# EAGLE design one_led (EAGLE 6.5.0)
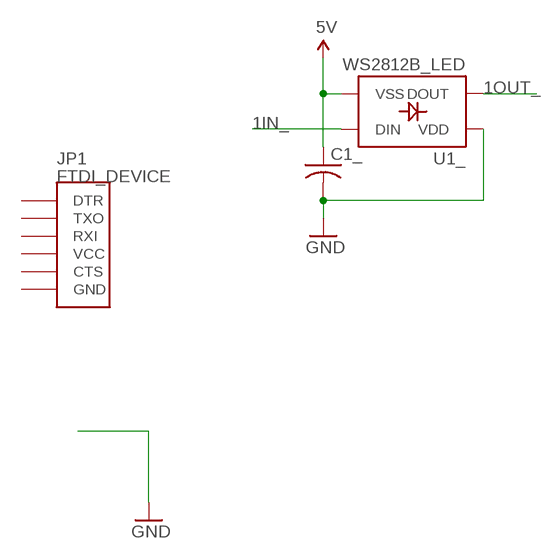
[diagram p0: schematic, sheet 1]

## Parts
C1_  C-USC0603K  [C0603K]
JP1  FTDI_DEVICE  [FTDI_DEVICE_SIDE]
U1_  WS2812B_LED  [WS2812B_LED]

## Nets
1IN_: U1_.DIN
1OUT_: U1_.DOUT
5V: C1_.1 U1_.VSS
GND: C1_.2 U1_.VDD
Unconnected: JP1.P$1(DTR) JP1.P$2(TXO) JP1.P$3(RXI) JP1.P$4(VCC) JP1.P$5(CTS) JP1.P$6(GND)

## Library data of the parts
C1_ = adafruit:C-US: CAPACITOR, American symbol
JP1 = SparkFun-Connectors:FTDI_DEVICE: Connector which mates to FTDI basic or FTDI cable.
U1_ = blinkinlabs:WS2812B_LED

## Board
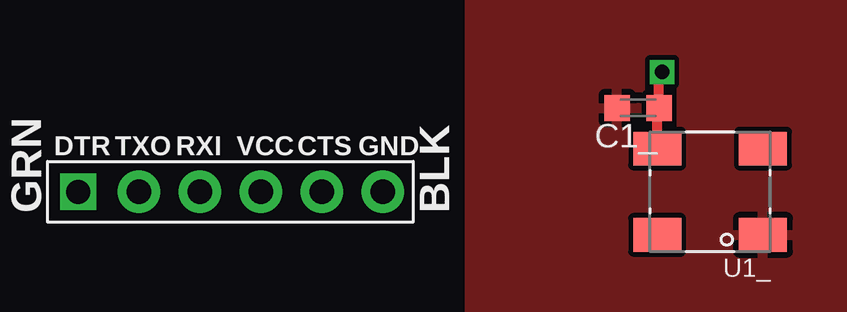
[diagram p1: board, top side]
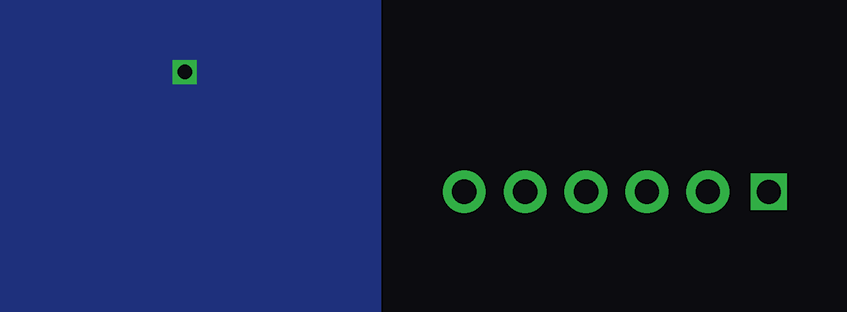
[diagram p2: board, bottom side, seen from below]

No outline drawn. Coordinates in mm, seen from the top.
Copper layers (1*16): Top 0.035mm / dielectric 1.5mm / Bottom 0.035mm
Design rules "default": minimum track width 10mil, minimum drill 24mil, track to track 8mil, track to pad 8mil, pad to pad 8mil, via to via 8mil, smd to smd 8mil, copper to edge 40mil, drill to drill 8mil, minimum pad ring 10mil, minimum via ring 8mil, stop-mask expansion 4mil, vias tented up to drill 0mil, thermal gap 10mil

### Footprints (pad centres in the part's own frame; a part is rotated, then mirrored left to right if it is on the bottom)
C0603K = smd 1.05 x 1.08: 1 -0.875,0; 2 0.875,0
FTDI_DEVICE_SIDE = drill 1 square: P$1 -6.35,0 | drill 1.016 pad 1.778: P$2 -3.81,0; P$3 -1.27,0; P$4 1.27,0; P$5 3.81,0; P$6 6.35,0
WS2812B_LED = smd 2 x 1.4: DIN 2.2,1.8; DOUT -2.2,-1.8; VDD -2.2,1.8; VSS 2.2,-1.8

### Placement (x,y rotation side)
C1_  -3,3.5 180 top
JP1  -20,0 0 top
U1_  0,0 180 top

### Tracks (layer width: path | path; a pad name or v marks a point on that pad's centre or on a via)
5V  (via drill 0.6)
  Top 0.406: U1_.VSS -2.2,3.42 C1_.1 -2.12,4.88 v-2,5
  pour Bottom: -10,10 140,10 140,-130 -10,-130
GND
  pour Top: -10,10 140,10 140,-130 -10,-130